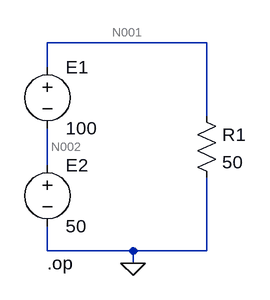
[diagram p0: schematic Draft3.asc]
Draft3.asc, the LTspice schematic file:
Version 4
SHEET 1 880 680
WIRE 208 48 0 48
WIRE 0 80 0 48
WIRE 208 144 208 48
WIRE 0 208 0 160
WIRE 0 320 0 288
WIRE 112 320 0 320
WIRE 208 320 208 224
WIRE 208 320 112 320
WIRE 112 336 112 320
FLAG 112 336 0
DATAFLAG 96 48 ""
SYMBOL voltage 0 64 R0
WINDOW 123 0 0 Left 0
WINDOW 39 0 0 Left 0
SYMATTR InstName E1
SYMATTR Value 100
SYMBOL voltage 0 192 R0
WINDOW 123 0 0 Left 0
WINDOW 39 0 0 Left 0
SYMATTR InstName E2
SYMATTR Value 50
SYMBOL res 192 128 R0
SYMATTR InstName R1
SYMATTR Value 50
TEXT 0 336 Left 2 !.op

The netlist it stands for:
* Draft3.asc
V§E1 N001 N002 100
V§E2 N002 0 50
R1 N001 0 50
.op
.backanno
.end

* Results of the author's LTspice run, read from the files saved beside the schematic
* Operating Point:
*   V(n001) = 150 V
*   V(n002) = 50 V
*   I(R1) = 3 A
*   I(E1) = -3 A
*   I(E2) = -3 A